# EAGLE design DRAMCarrier_250466 (EAGLE 7.7.0)
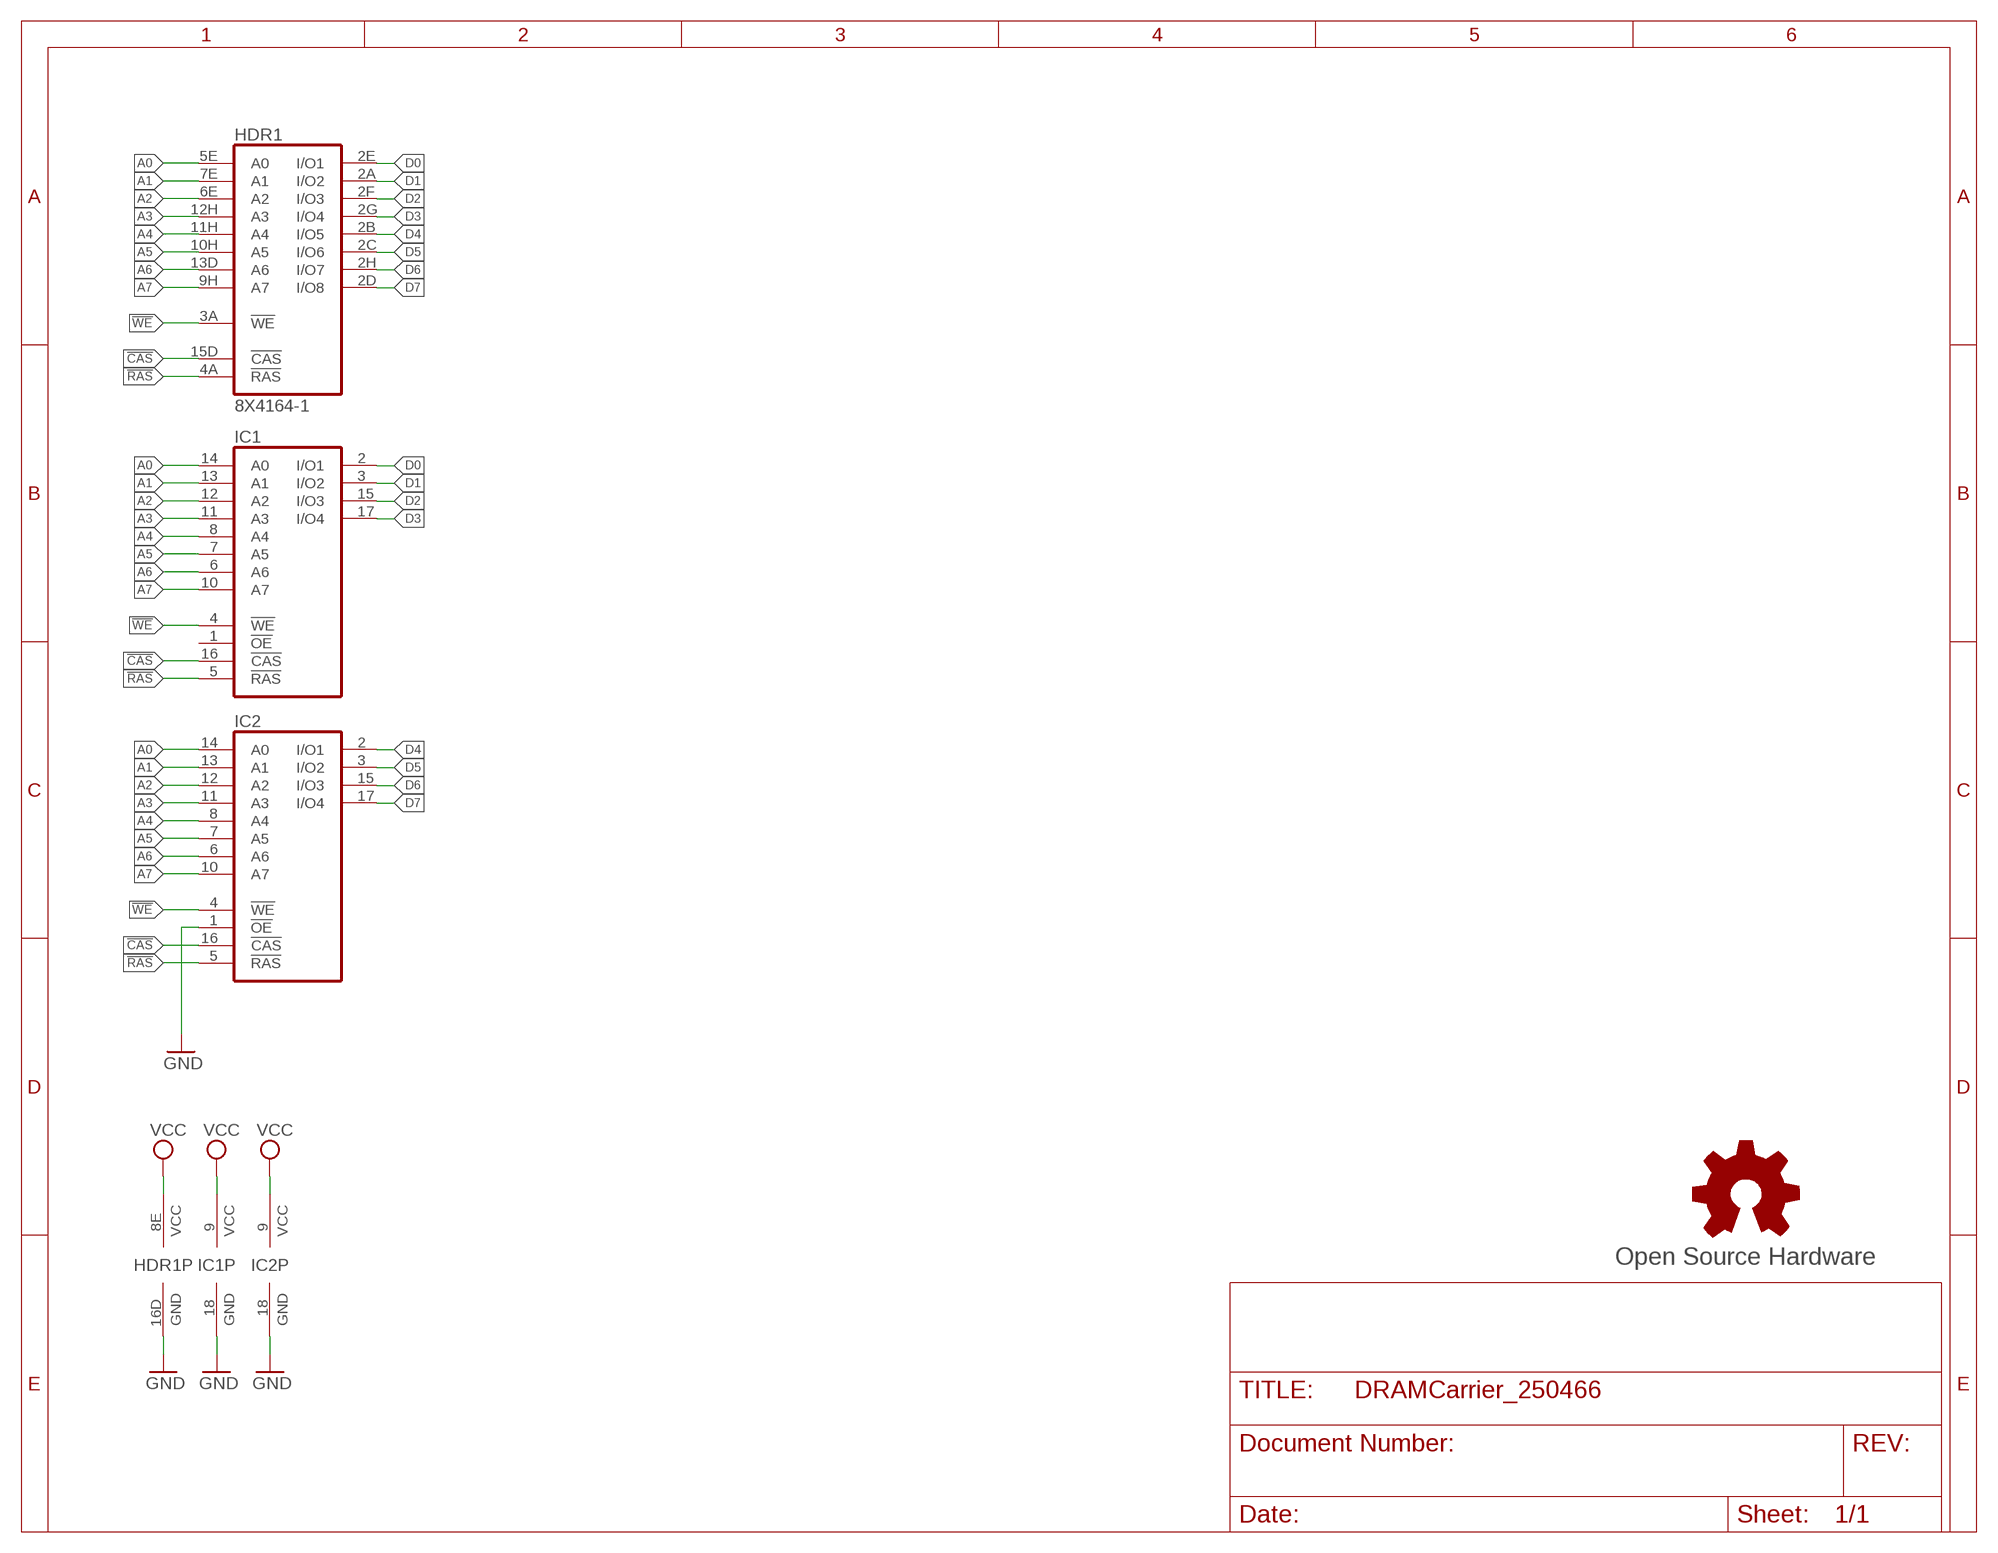
[diagram p0: schematic, sheet 1]

## Parts
GOLD_ORB_SM1  Open Source Hardware  OSHWLOGOLOGO8MM  [OSHW_8MM]
HDR1  8X4164-1  [8XDIL16_REV]
IC1  41464C  [DIL18]
IC2  41464C  [DIL18]

## Nets
!CAS: HDR1.15D(!CAS) IC1.16(!CAS) IC2.16(!CAS)
!RAS: HDR1.4A(!RAS) IC1.5(!RAS) IC2.5(!RAS)
!WE: HDR1.3A(!WE) IC1.4(!WE) IC2.4(!WE)
A0: HDR1.5E(A0) IC1.14(A0) IC2.14(A0)
A1: HDR1.7E(A1) IC1.13(A1) IC2.13(A1)
A2: HDR1.6E(A2) IC1.12(A2) IC2.12(A2)
A3: HDR1.12H(A3) IC1.11(A3) IC2.11(A3)
A4: HDR1.11H(A4) IC1.8(A4) IC2.8(A4)
A5: HDR1.10H(A5) IC1.7(A5) IC2.7(A5)
A6: HDR1.13D(A6) IC1.6(A6) IC2.6(A6)
A7: HDR1.9H(A7) IC1.10(A7) IC2.10(A7)
D0: HDR1.2E(I/O1) IC1.2(I/O1)
D1: HDR1.2A(I/O2) IC1.3(I/O2)
D2: HDR1.2F(I/O3) IC1.15(I/O3)
D3: HDR1.2G(I/O4) IC1.17(I/O4)
D4: HDR1.2B(I/O5) IC2.2(I/O1)
D5: HDR1.2C(I/O6) IC2.3(I/O2)
D6: HDR1.2H(I/O7) IC2.15(I/O3)
D7: HDR1.2D(I/O8) IC2.17(I/O4)
GND: HDR1.16D(GND) IC1.18(GND) IC2.1(!OE) IC2.18(GND)
VCC: HDR1.8E(VCC) IC1.9(VCC) IC2.9(VCC)
Unconnected: IC1.1(!OE)

## Library data of the parts
GOLD_ORB_SM1 = oshw:OSHWLOGO: The OSHW logo for PCB layout
HDR1 = commodore:8X4164
IC1 IC2 = memory-jlb:41464C: MEMORY; OC_FARNELL: unknown; OC_NEWARK: unknown

## Board
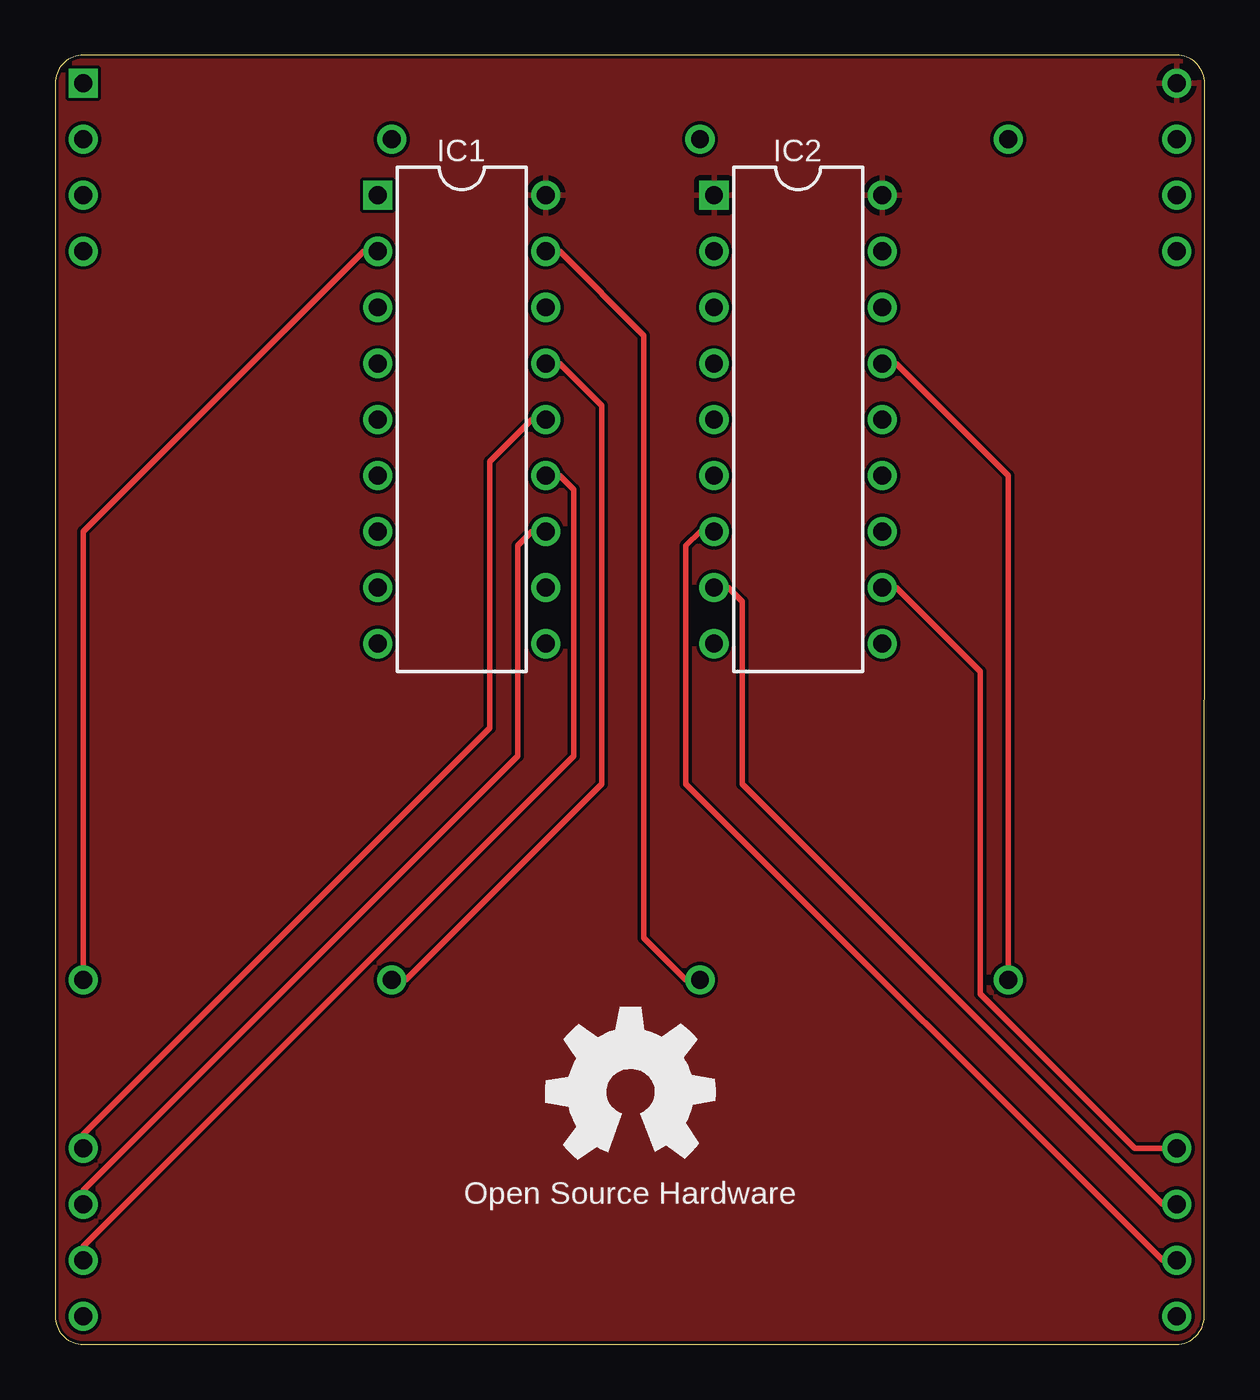
[diagram p1: board, top side]
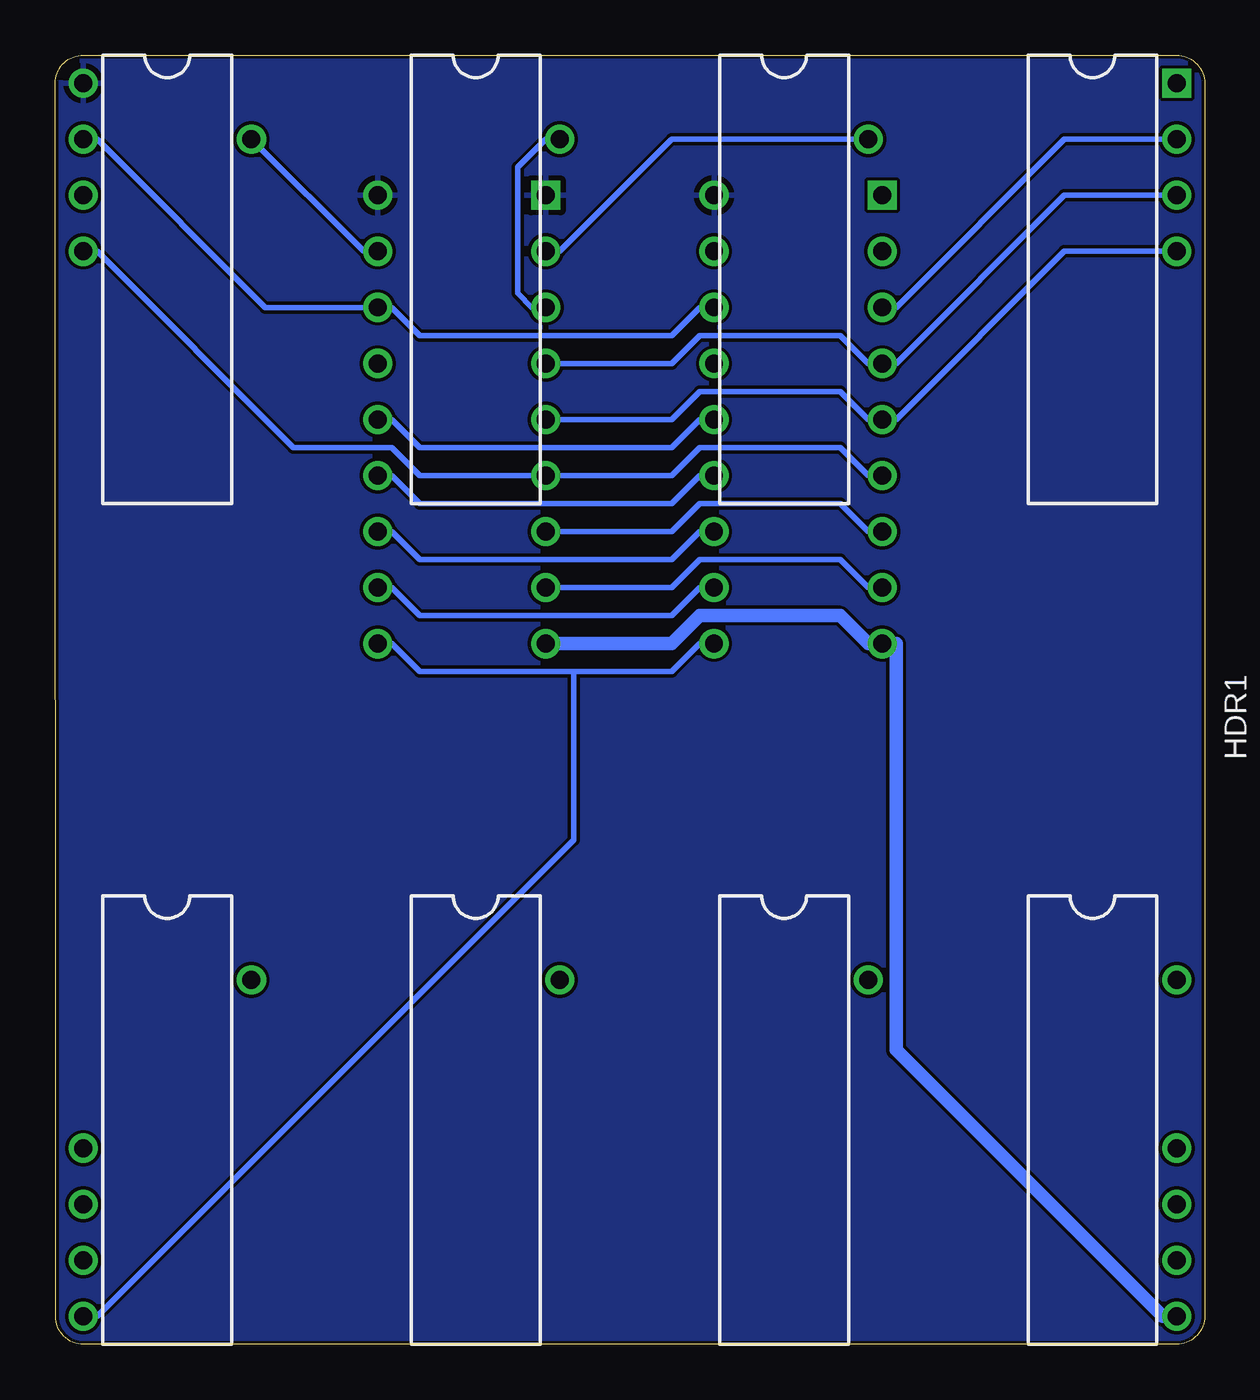
[diagram p2: board, bottom side, seen from below]

Size 52.07 x 58.42 mm. Coordinates in mm from the lower left corner, seen from the top.
Outline: 0,57.15 0,1.27 arc90 1.27,0 50.78,0 arc90 52.05,1.27 52.07,57.15 arc90 50.8,58.42 1.27,58.42 arc90 0,57.15
Copper layers (1*16): Top 0.035mm / dielectric 1.5mm / Bottom 0.035mm
Design rules "hackvana *": minimum track width 6mil, minimum drill 0.3mm, track to track 6mil, track to pad 6mil, pad to pad 6mil, via to via 6mil, smd to smd 0mil, copper to edge 6mil, drill to drill 6mil, minimum pad ring 10mil, minimum via ring 6mil, stop-mask expansion 2mil, vias tented up to drill 100mil, thermal gap 10mil

### Footprints (pad centres in the part's own frame; a part is rotated, then mirrored left to right if it is on the bottom)
8XDIL16_REV = drill 0.813 square: 1A -25.4,27.94 | drill 0.813: 2A -25.4,25.4; 2B -11.43,25.4; 2C 2.54,25.4; 2D 16.51,25.4; 2E -25.4,-12.7; 2F -11.43,-12.7; 2G 2.54,-12.7; 2H 16.51,-12.7; 3A -25.4,22.86; 4A -25.4,20.32; 5E -25.4,-20.32; 6E -25.4,-22.86; 7E -25.4,-25.4; 8E -25.4,-27.94; 9H 24.13,-27.94; 10H 24.13,-25.4; 11H 24.13,-22.86; 12H 24.13,-20.32; 13D 24.13,20.32; 14D 24.13,22.86; 15D 24.13,25.4; 16D 24.13,27.94
DIL18 = drill 0.813 square: 1 -10.16,-3.81 | drill 0.813: 2 -7.62,-3.81; 3 -5.08,-3.81; 4 -2.54,-3.81; 5 0,-3.81; 6 2.54,-3.81; 7 5.08,-3.81; 8 7.62,-3.81; 9 10.16,-3.81; 10 10.16,3.81; 11 7.62,3.81; 12 5.08,3.81; 13 2.54,3.81; 14 0,3.81; 15 -2.54,3.81; 16 -5.08,3.81; 17 -7.62,3.81; 18 -10.16,3.81

### Placement (x,y rotation side)
GOLD_ORB_SM1  26.04,11.43 0 top
HDR1  26.67,29.21 0 top
IC1  18.41,41.91 270 top
IC2  33.66,41.91 270 top

### Tracks (layer width: path | path; a pad name or v marks a point on that pad's centre or on a via)
!CAS
  Bottom 0.254: IC1.16 22.86,46.99 24.13,45.72 35.56,45.72 36.83,46.99 IC2.16 42.55,46.99 50.17,54.61 HDR1.15D
!RAS
  Bottom 0.254: IC2.5 24.13,41.91 22.86,43.18 16.51,43.18 15.24,41.91 IC1.5 13.97,41.91 6.35,49.53 HDR1.4A
!WE
  Bottom 0.254: HDR1.3A 6.35,52.07 13.97,44.45 IC1.4 15.24,44.45 16.51,45.72 22.86,45.72 24.13,44.45 IC2.4
A0
  Top 0.254: HDR1.5E 1.27,9.53 19.69,27.94 19.69,40.01 21.59,41.91 IC1.14
  Bottom 0.254: IC2.14 36.83,41.91 35.56,40.64 24.13,40.64 22.86,41.91 IC1.14
A1
  Top 0.254: HDR1.7E 1.27,4.45 23.5,26.67 23.5,38.74 22.86,39.37 IC1.13
  Bottom 0.254: IC2.13 36.83,39.37 35.56,38.1 24.13,38.1 22.86,39.37 IC1.13
A2
  Top 0.254: HDR1.6E 1.27,6.98 20.96,26.67 20.96,36.2 21.59,36.83 IC1.12
  Bottom 0.254: IC2.12 36.83,36.83 35.56,35.56 24.13,35.56 22.86,36.83 IC1.12
A3
  Top 0.254: HDR1.12H 48.9,8.89 41.91,15.88 41.91,30.48 38.1,34.29 IC2.11
  Bottom 0.254: IC2.11 36.83,34.29 35.56,33.02 24.13,33.02 22.86,34.29 IC1.11
A4
  Top 0.254: HDR1.11H 50.17,6.35 31.12,25.4 31.12,33.66 30.48,34.29 IC2.8
  Bottom 0.254: IC1.8 15.24,34.29 16.51,35.56 22.86,35.56 24.13,34.29 IC2.8
A5
  Top 0.254: HDR1.10H 50.17,3.81 28.58,25.4 28.58,36.2 29.21,36.83 IC2.7
  Bottom 0.254: IC1.7 15.24,36.83 16.51,38.1 22.86,38.1 24.13,36.83 IC2.7
A6
  Bottom 0.254: IC1.6 15.24,39.37 16.51,40.64 22.86,40.64 24.13,39.37 IC2.6 35.56,39.37 36.83,40.64 41.28,40.64 50.17,49.53 HDR1.13D
A7
  Bottom 0.254: IC2.10 36.83,31.75 35.56,30.48 28.58,30.48 | IC1.10 22.86,31.75 24.13,30.48 28.58,30.48 | HDR1.9H 50.17,1.27 28.58,22.86 28.58,30.48
D0
  Top 0.254: HDR1.2E 1.27,36.83 13.97,49.53 IC1.2
D1
  Bottom 0.254: HDR1.2A 6.35,54.61 13.97,46.99 IC1.3
D2
  Top 0.254: HDR1.2F 15.88,16.51 24.77,25.4 24.77,42.55 22.86,44.45 IC1.15
D3
  Top 0.254: HDR1.2G 28.58,16.51 26.67,18.41 26.67,45.72 22.86,49.53 IC1.17
D4
  Bottom 0.254: HDR1.2B 24.13,54.61 29.21,49.53 IC2.2
D5
  Bottom 0.254: IC2.3 30.48,46.99 31.12,47.62 31.12,53.34 29.85,54.61 HDR1.2C
D6
  Top 0.254: HDR1.2H 43.18,39.37 38.1,44.45 IC2.15
D7
  Bottom 0.254: IC2.17 38.1,49.53 HDR1.2D
GND
  pour Top: 52.07,57.15 52.07,1.27 arc-90 50.8,0 1.27,0 arc-90 0,1.27 0,57.15 arc-90 1.27,58.42 50.8,58.42 arc-90
  pour Bottom: 52.07,57.15 52.07,1.27 arc-90 50.8,0 1.27,0 arc-90 0,1.27 0,57.15 arc-90 1.27,58.42 50.8,58.42 arc-90
VCC
  Bottom 0.61: HDR1.8E 1.91,1.27 13.97,13.33 13.97,31.75 IC1.9 15.24,31.75 16.51,33.02 22.86,33.02 24.13,31.75 IC2.9

### Text on the board
tValues: DRAM Carrier (250466) / (c)2019 RETRO Innovations / www.go4retro.com